# Altium schematic sheet Принципиальная схема 466250_004.SchDoc
size 420 x 297 mm; CompanyName: MOSTЫ; Organization: MOSTЫ; SheetNumber: 1; SheetTotal: 1; PageSetup: Record=PageOptions|CenterHorizontal=True|CenterVertical=True|PrintScale=0.94|XCorrection=1.00|YCorrection=1.00|PrintKind=1|BorderSize=5000000|LeftOffset=0|BottomOffset=0|Orientation=1|PaperLength=1000|PaperWidth=1000|Scale=100|PaperSource=7|PrintQuality=-4|MediaType=1|DitherType=10|PaperKind=A4|PrintScaleMode=1; DecimalNumber: XXXX.466259.004; Name1: Полётный контроллер; Name2: самолётный
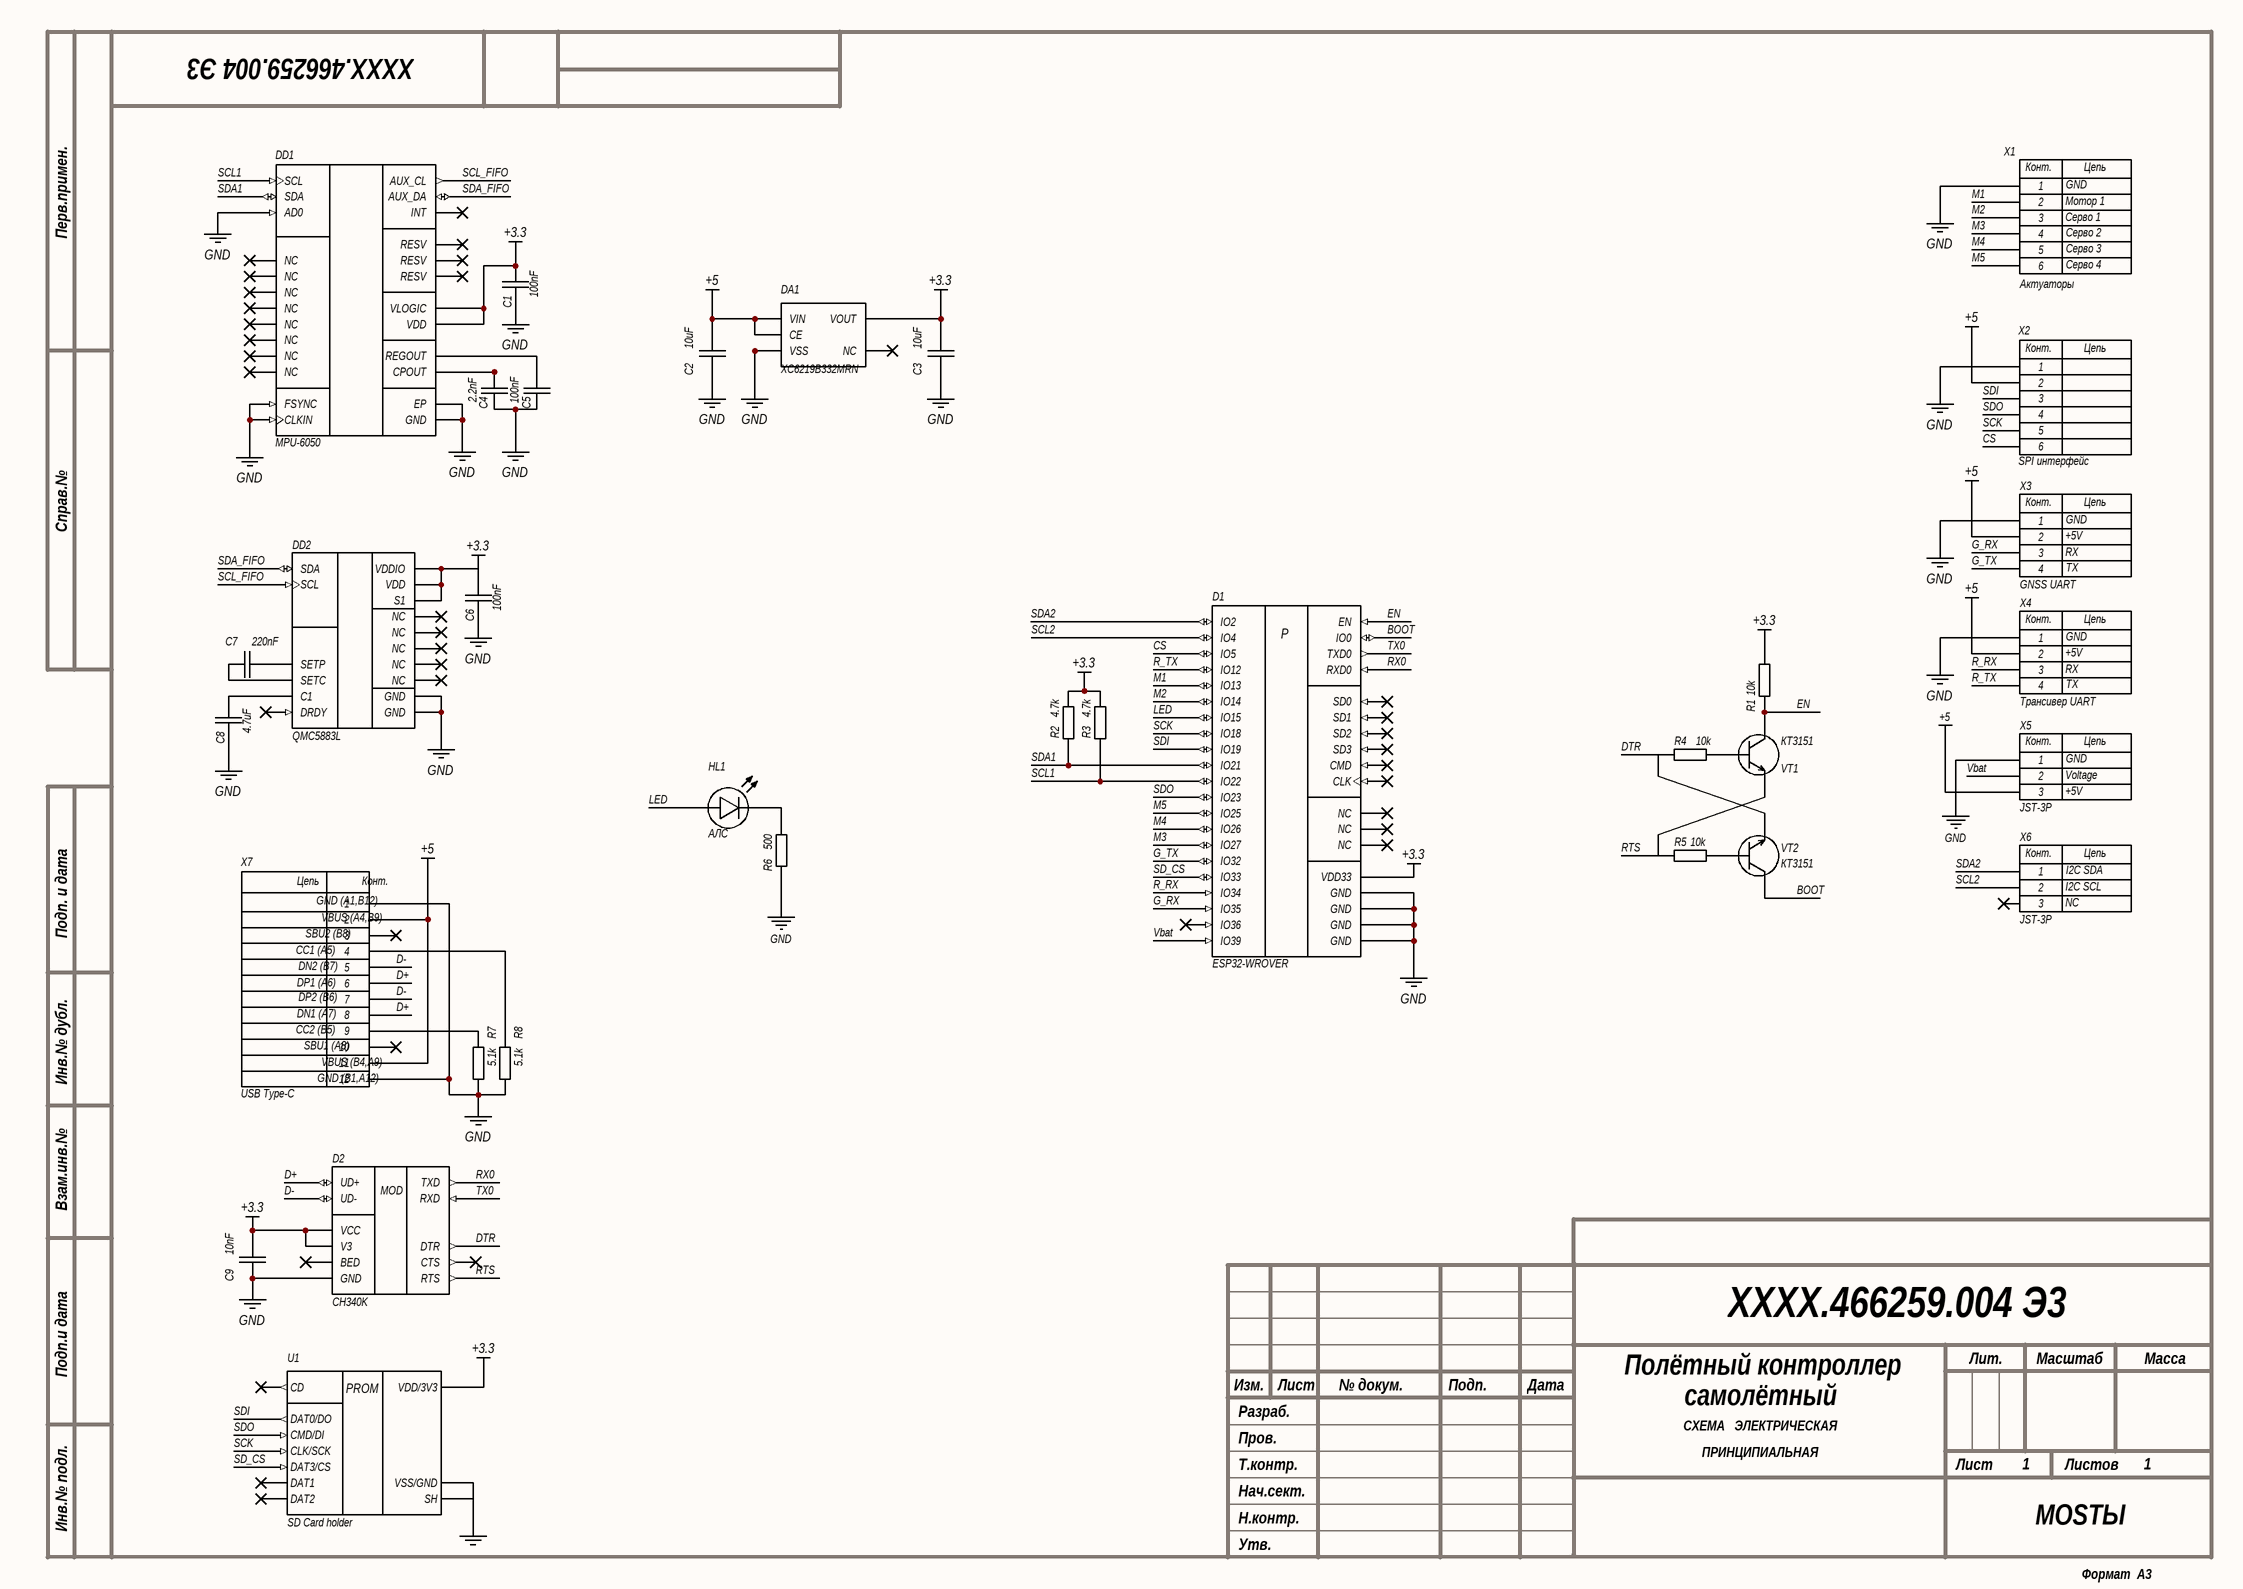
[diagram p0: Принципиальная схема 466250_004.SchDoc]

## Parts
C1  100nF  [CAPC2012X10N]
C2  10uF  [CAPC2012X10N]
C3  10uF  [CAPC2012X10N]
C4  2.2nF  [CAPC2012X10N]
C5  100nF  [CAPC2012X10N]
C6  100nF  [CAPC2012X10N]
C7  220nF  [CAPC2012X10N]
C8  4.7uF  [CAPC2012X10N]
C9  10nF  [CAPC2012X10N]
D1  ESP32-WROVER  [FP-ESP32-WROVER-MFG]
D2  CH340K  [CH340K no bed]
DA1  XC6219B332MRN  [SOT95P280X130-5N]
DD1  MPU-6050  [IS-QFN-24_V]
DD2  QMC5883L  [FP-QMC5883L]
HL1  АЛС  [LED 0805]
R1  10k  [RES0805]
R2  4.7k  [RES0805]
R3  4.7k  [RES0805]
R4  10k  [RES0805]
R5  10k  [RES0805]
R6  500  [RES0805]
R7  5.1k  [RES0805]
R8  5.1k  [RES0805]
U1  SD Card holder  [SD Card holder]
VT1  КТ3151  [SOT-23]
VT2  КТ3151  [SOT-23]
X1  Актуаторы  [JST-SM06B-SRSS-TB_V]
X2  SPI интерфейс  [JST-SM06B-SRSS-TB_V]
X3  GNSS UART  [JST-SH04B]
X4  Трансивер UART  [JST-SH04B]
X5  JST-3P  [61300311121]
X6  JST-3P  [61300311121]
X7  USB Type-C  [USB TYPE-C 12PIN]

## Nets
+3.3: C1.1(+) C3.1(+) C6.1(+) C9.1(+) D1.2(VDD33) D2.7(VCC) D2.10(V3) DA1.5(VOUT) DD1.8(VLOGIC) DD1.13(VDD) DD2.2(VDD) DD2.4(S1) DD2.13(VDDIO) R1.2 R2.2 R3.2 U1.4(VDD/3V3)
+5: C2.1(+) DA1.1(VIN) DA1.3(CE) X2.2 X3.2 X4.2 X5.3 X7.2 X7.11
GND: C1.2(-) C2.2(-) C3.2(-) C4.2(-) C5.2(-) C6.2(-) C8.2(-) C9.2(-) D1.1(GND) D1.15(GND) D1.38(GND) D1.39(GND) D2.3(GND) DA1.2(VSS) DD1.1(CLKIN) DD1.9(AD0) DD1.11(FSYNC) DD1.18(GND) DD1.25(EP) DD2.9(GND) DD2.11(GND) R6.1 R7.2 R8.2 U1.6(VSS/GND) U1.SH X1.1 X2.1 X3.1 X4.1 X5.1 X7.1 X7.12
BOOT: D1.25(IO0) VT2.3(C)
CS: D1.29(IO5) X2.6
D+: D2.1(UD+) X7.6 X7.8
D-: D2.2(UD-) X7.5 X7.7
DTR: D2.4(DTR) R4.1 VT2.2(E)
EN: D1.3(EN) R1.1 VT1.3(C)
G_RX: D1.7(IO35) X3.3
G_TX: D1.8(IO32) X3.4
LED: D1.23(IO15) HL1.1
M1: D1.16(IO13) X1.2
M2: D1.13(IO14) X1.3
M3: D1.12(IO27) X1.4
M4: D1.11(IO26) X1.5
M5: D1.10(IO25) X1.6
R_RX: D1.6(IO34) X4.3
R_TX: D1.14(IO12) X4.4
RTS: D2.6(RTS) R5.1 VT1.2(E)
RX0: D1.34(RXD0) D2.8(TXD)
SCK: D1.30(IO18) U1.5(CLK/SCK) X2.5
SCL1: D1.36(IO22) DD1.23(SCL) R3.1
SCL2: D1.26(IO4) X6.2
SCL_FIFO: DD1.7(AUX_CL) DD2.1(SCL)
SD_CS: D1.9(IO33) U1.2(DAT3/CS)
SDA1: D1.33(IO21) DD1.24(SDA) R2.1
SDA2: D1.24(IO2) X6.1
SDA_FIFO: DD1.6(AUX_DA) DD2.16(SDA)
SDI: D1.31(IO19) U1.7(DAT0/DO) X2.3
SDO: D1.37(IO23) U1.3(CMD/DI) X2.4
TX0: D1.35(TXD0) D2.9(RXD)
Vbat: D1.5(IO39) X5.2
NetC4_1: C4.1(+) DD1.20(CPOUT)
NetC5_1: C5.1(+) DD1.10(REGOUT)
NetC7_1: C7.1(+) DD2.8(SETP)
NetC7_2: C7.2(-) DD2.12(SETC)
NetC8_1: C8.1(+) DD2.10(C1)
NetHL1_2: HL1.2 R6.2
NetR4_2: R4.2 VT1.1(B)
NetR5_2: R5.2 VT2.1(B)
NetR7_1: R7.1 X7.9
NetR8_1: R8.1 X7.4

Not connected (* = marked no-connect by the designer): D1 4(IO36)* 17(SD2)* 18(SD3)* 19(CMD)* 20(CLK)* 21(SD0)* 22(SD1)* 27(NC)* 28(NC)* 32(NC)*; D2 5(CTS)* 11(BED)*; DA1 4(NC)*; DD1 2(NC)* 3(NC)* 4(NC)* 5(NC)* 12(INT)* 14(NC)* 15(NC)* 16(NC)* 17(NC)* 19(RESV)* 21(RESV)* 22(RESV)*; DD2 3(NC)* 5(NC)* 6(NC)* 7(NC)* 14(NC)* 15(DRDY)*; U1 1(DAT2)* 8(DAT1)* 9(CD)*; X6 3*; X7 3* 10*

## Notes on the sheet
- Перв.примен.
- Справ.№
- Подп. и дата
- Инв.№ дубл.
- Взам.инв.№
- Подп.и дата
- Разраб.
- Изм.
- Лист
- № докум.
- Подп.
- Дата
- Лит.
- Масштаб
- Масса
- Т.контр.
- Пров.
- СХЕМА   ЭЛЕКТРИЧЕСКАЯ
- ПРИНЦИПИАЛЬНАЯ
- Листов
- Инв.№ подл.
- Утв.
- Н.контр.
- Нач.сект.
- Формат  A3
- (in symbol CH340K) MOD
- (in symbol ESP32-WROVER) P
- (in symbol JST-3P) Конт.; Цепь
- (in symbol JST-6P) Конт.; Цепь
- (in symbol JST-SH1.0-4) Конт.; Цепь
- (in symbol JST-SH1.0-8) Конт.; Цепь
- (in symbol SD Card holder) PROM
- (in symbol USB Type-C 12pin) Цепь; Конт.; GND (A1,B12); VBUS (A4,B9); SBU2 (B8); CC1 (A5); DN2 (B7); DP1 (A6); DP2 (B6); DN1 (A7); CC2 (B5); SBU1 (A8); VBUS (B4,A9); GND (B1,A12)

## Library data of the parts
C1-C9 = Capasitor SMD
  C1 C4 C5: ClassName: IMU
  C2 C3 C9: ClassName: Power
  C6-C8: ClassName: Compass
D1 = ESP32-WROVER: SMD MODULE, ESP32-D0WDQ6, 32MBIT; Manufacturer: Espressif Systems; Interface: I2C,SPI,UART,I2S,Other; Number Of Adc Channels: 16; Data Rate: 150Mbits/s; Number Of Gpio: 20; Sensitivity: -98dBm; Max Frequency: 2.5GHz; Bandwidth: 0.1GHz; Max Supply Voltage: 3.6V; Min Supply Voltage: 2.3V; Nominal Supply Current: 80mA; Height: 3.4mm; Device Class L3: Transceivers; Octopart: https://octopart.com/esp32-wrover-espressif+systems-89171348; Device Class L2: RF Semiconductors and Devices; ComponentLink2Description: Datasheet; RoHS: TRUE; Lead Free: Yes; Device Class L1: Integrated Circuits (ICs); Temperature Range High: +85°C; Digikey Description: SMD MODULE, ESP32-D0WDQ6, 32MBIT; Package: ESP32-WROVER; Mouser Description: Bluetooth and Wi-Fi Module 2.4GHz to 2.5GHz 2.3V to 3.6V 38-Pin SMD Module; Temperature: -40°C to +85°C; Category: UNK; Manufacturer Part Number: ESP32-WROVER; Automotive: No; Temperature Range Low: -40°C; ComponentLink2URL: https://forum.upverter.com/uploads/default/original/3X/1/9/19ab4f33dd815ce1b2b0bb210f0ab7d5aab1dea3.pdf
D2 = CH340K: USB-RS232 ESSOP10
DA1 = XC6219B332MRN: Voltage stabilizer 3.3v 350mA; Manufacturer_Name: Torex; Datasheet Link: https://componentsearchengine.com/Datasheets/2/XC6219B332MRN.pdf; Height: 1.3mm; Manufacturer_Part_Number: XC6219B332MRN; ClassName: Power
DD1 = MPU-6050: 3-Axis Gyroscope, Accelerometer and a Digital Motion Processor(TM) (DMP), 2.375 to 3.46 V, -40 to 85 degC, 24-Pin QFN, RoHS, Tape and Reel; Manufacturer: InvenSense; Featured Product: MPU-60506-Axis,IntegratedI²CSolution; Other Names: 1428-1007-2 / MPU6050; Sensor Type: MotionTracking; Online Catalog: MPU-6000™Series; Unit PriceUSD: Digital; Datasheet Version: Rev. 3.3, 05/2012; Category: Sensors,Transducers; Datasheet URL: http://datasheet.octopart.com/MPU-6050-InvenSense-datasheet-14421344.pdf; Family: Multifunction; Standard Package: 5,000; Manufacturer URL: http://www.invensense.com/; Output Type: Digital; Dynamic Catalog: MPU-6000™Series; Parameter 1: *; ClassName: IMU
DD2 = QMC5883L: SENSOR MR I2C 16LCC; Min Supply Voltage: 2.16V; Operating Supply Current: 100uA; Max Supply Voltage: 3.6V; Operating Supply Voltage: 2.5V; Min Operating Temperature: -30°C; Interface: I2C; Max Operating Temperature: 85°C; Package Quantity: 4000; REACH SVHC: No SVHC; Case/Package: LCC; Packaging: Tape and Reel; Number of Pins: 16; Radiation Hardening: No; ClassName: Compass
HL1 = Светодиод
R1-R8 = Резистор SMD: SMD resistors with differents footprints
VT1 VT2 = NPN транзистор: NPN TRANSISTOR; Max Collector Current: 1.5A; Transition Frequency: 100MHz; Max Breakdown Voltage: 25V; Collector Emitter Voltage (VCEO): 400mV; Max Power Dissipation: 300mW; Case/Package: TO-236-3; Packaging: Tape and Reel; RoHS Compliant: Yes; Mount: Surface Mount; Collector Emitter Breakdown Voltage: 25V
X1 = JST-SH1.0-8: Net1: GND; Net2: Мотор 1; Net3: Серво 1; Net4: Серво 2; Net5: Серво 3; Net6: Серво 4; Net8: Изм. тока; Net7: -
X2 = JST-6P: JST type connector
X3 X4 = JST-SH1.0-4: Net1: GND; Net2: +5V; Net3: RX; Net4: TX
X5 = JST-3P: JST type connector; Net1: GND; Net2: Voltage; Net3: +5V
X6 = JST-3P: JST type connector; Net1: I2C SDA; Net2: I2C SCL; Net3: NC
X7 = USB Type-C 12pin: USB-C socket 12 pin        16Pin (12pin + 4 mount) Horizontal                 https://aliexpress.ru/item/1005006353547160.html?spm=a2g2w.orderdetail.0.0.5a244aa6hfTm5W&sku_id=12000041186006182; Model: *; Manufacturer: *; HelpURL: *; ComponentKind: *